# EAGLE design DPS_PWM-00 (EAGLE 7.2.0)
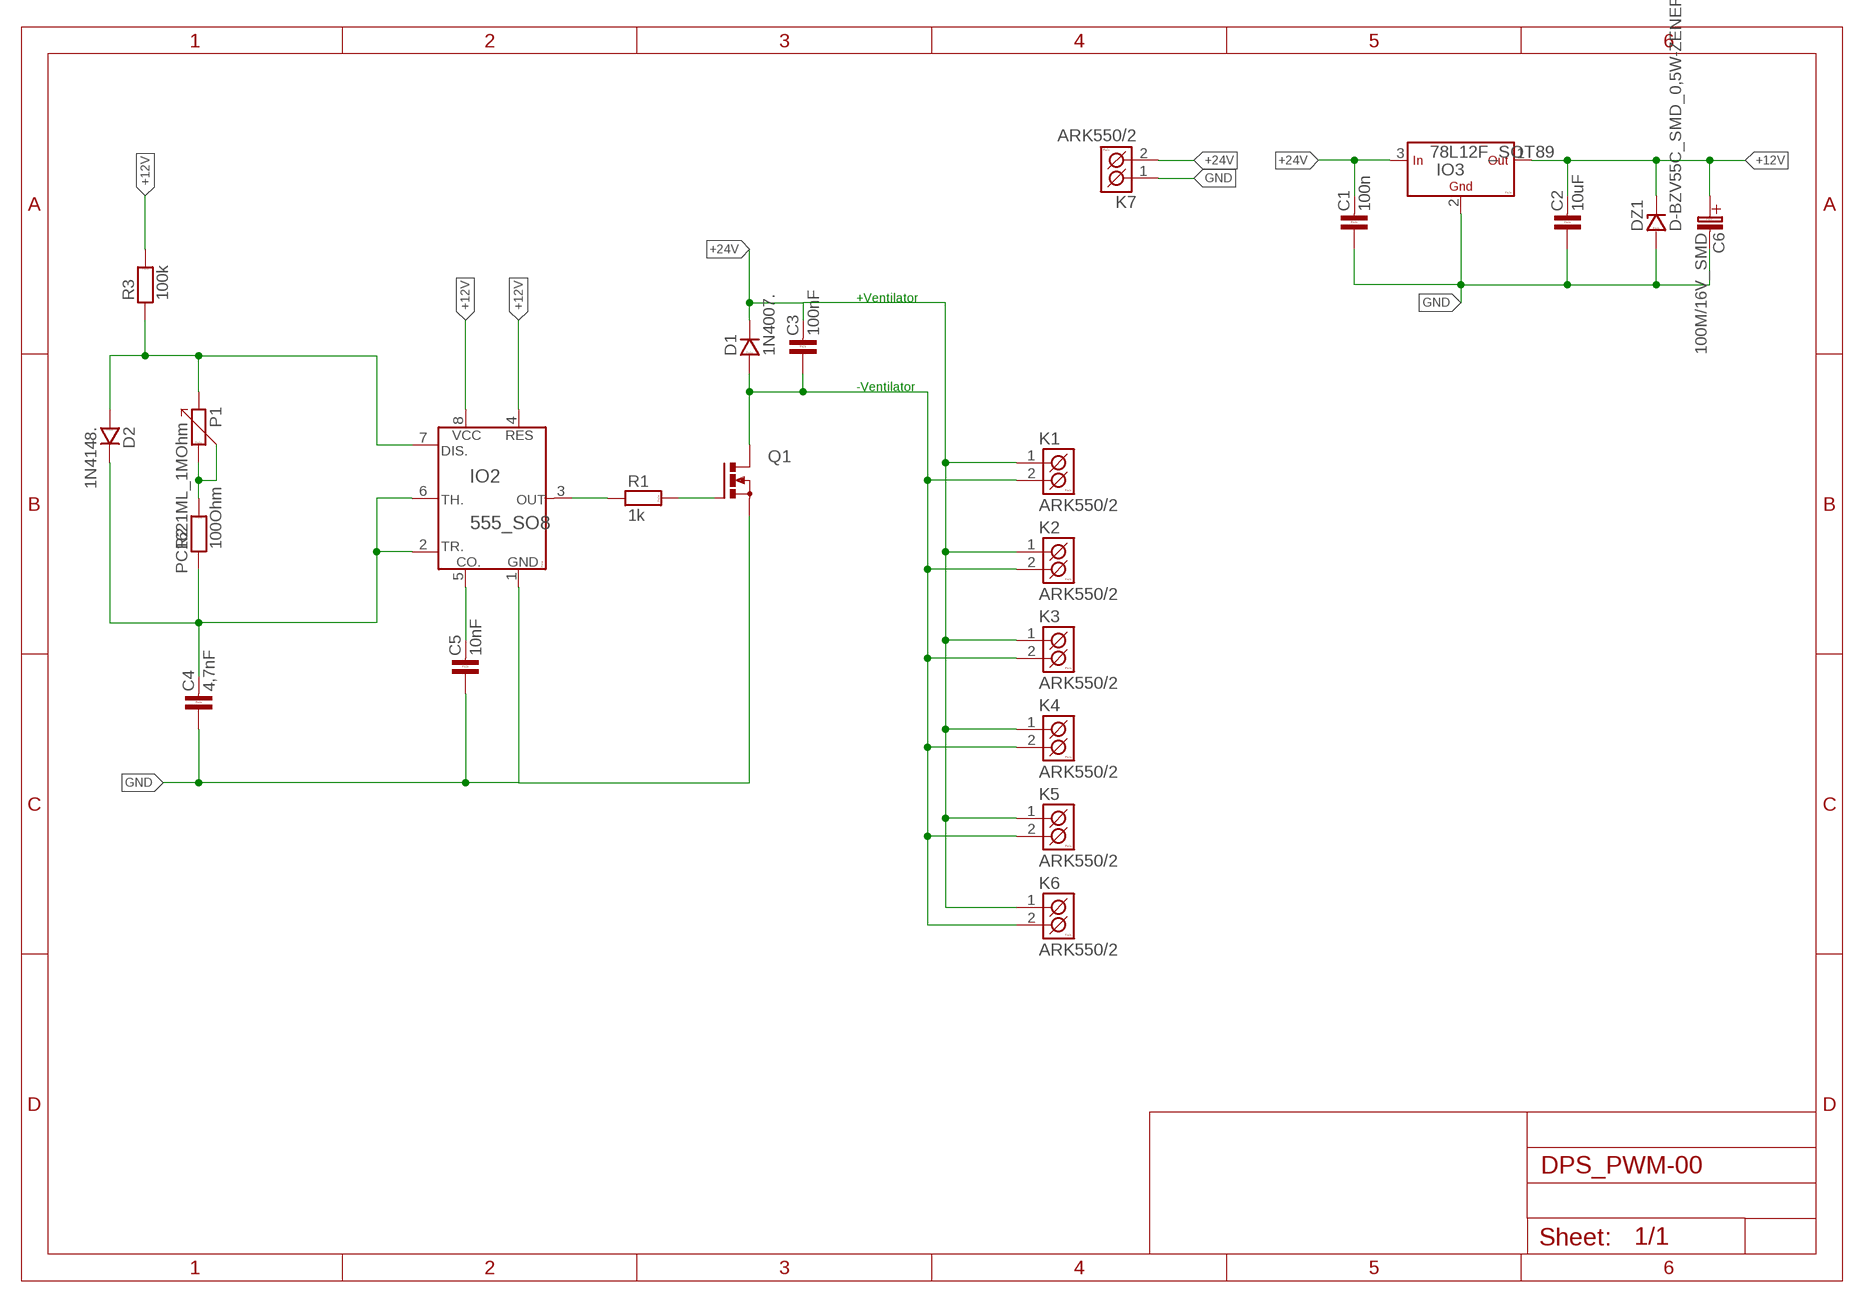
[diagram p0: schematic, sheet 1]

## Parts
C1  100n  C-KER_1206  [1206]
C2  10uF  C-KER_1206  [1206]
C3  100nF  C-KER_1206  [1206]
C4  4,7nF  C-KER_1206  [1206]
C5  10nF  C-KER_1206  [1206]
C6  100M/16V_SMD  [C_EL-SMD_D]
D1  1N4007.  [SM-1]
D2  1N4148.  [SOD-80]
DZ1  D-BZV55C_SMD_0,5W-ZENER  [SOD-80]
IO2  555_SO8  [SO08]
IO3  78L12F_SOT89  78_SOT  [SOT-89]
K1  ARK550/2  [ARK550/2]
K2  ARK550/2  [ARK550/2]
K3  ARK550/2  [ARK550/2]
K4  ARK550/2  [ARK550/2]
K5  ARK550/2  [ARK550/2]
K6  ARK550/2  [ARK550/2]
K7  ARK550/2  [ARK550/2]
P1  PC1621ML_1MOhm  PC16ML  [PC16ML]
Q1  PMOSFET_NTO220BH  [TO220BH]
R1  1k  R_1206  [1206]
R2  100Ohm  R_1206  [1206]
R3  100k  R_1206  [1206]

## Nets
+12V: C2.2 C6.+(C_EL+) DZ1.K IO2.4(RES) IO2.8(VCC) IO3.1(OUT) R3.2
+24V: C1.2 C3.2 D1.K IO3.3(IN) K1.1(K1) K2.1(K1) K3.1(K1) K4.1(K1) K5.1(K1) K6.1(K1) K7.2(K2)
GND: C1.1 C2.1 C4.1 C5.1 C6.-(C_EL-) DZ1.A IO2.1(GND) IO3.2(GND) K7.1(K1) Q1.S
N$1: C4.2 D2.K IO2.2(TR.) IO2.6(TH.) R2.1
N$2: P1.2 P1.3 R2.2
N$3: D2.A IO2.7(DIS.) P1.1 R3.1
N$6: C5.2 IO2.5(CO.)
N$7: Q1.G R1.2
N$8: IO2.3(OUT) R1.1
N$9: C3.1 D1.A K1.2(K2) K2.2(K2) K3.2(K2) K4.2(K2) K5.2(K2) K6.2(K2) Q1.D

## Notes on the sheet
- +Ventilator
- -Ventilator

## Library data of the parts
C1-C5 = #PaJa_31:C-KER: Kondenzator - keramicky
C6 = #PaJa_C-el_2:100M/16V
D1 = #PaJa_31:1N4007: Usmernovaci dioda - 1A, 1000V
D2 = #PaJa_31:1N4148: Univerzalni dioda - 0,15A, 75V
DZ1 = #PaJa_31:D-?-ZENER: Zenerova dioda
IO2 = #PaJa_31:555: IO - Casovac 555
IO3 = #PaJa_31:78?: Stabilizator - 1A a 1,5A ? - napeti => 05, 06, 08, 09, 12, 15, 18, 20, 24 => 1,5A ? - napeti => 10, 12, 15, 18 => 1A S ? - napeti => 05, 09, 10, 12, 15, 18, 24 => 2A T ? - napeti => 05 => 3A ------------------------------------------------------- Stabilizator - 100mA (TO-92 , SOT-89) ? - napeti => 02, 05, 06, 08, 09, 12, 15, 18
K1-K7 = #PaJa_konektory:ARK550/2: Svorkovnice - roztec 3,5mm - dvojita
P1 = #PaJa_31:PC16ML: Potenciometr - plastovy - mono - 100R az 5M
Q1 = transistor-power:PMOSFET_N: Power MOSFET N-Channel
R1-R3 = #PaJa_31:R: Rezistor

## Board
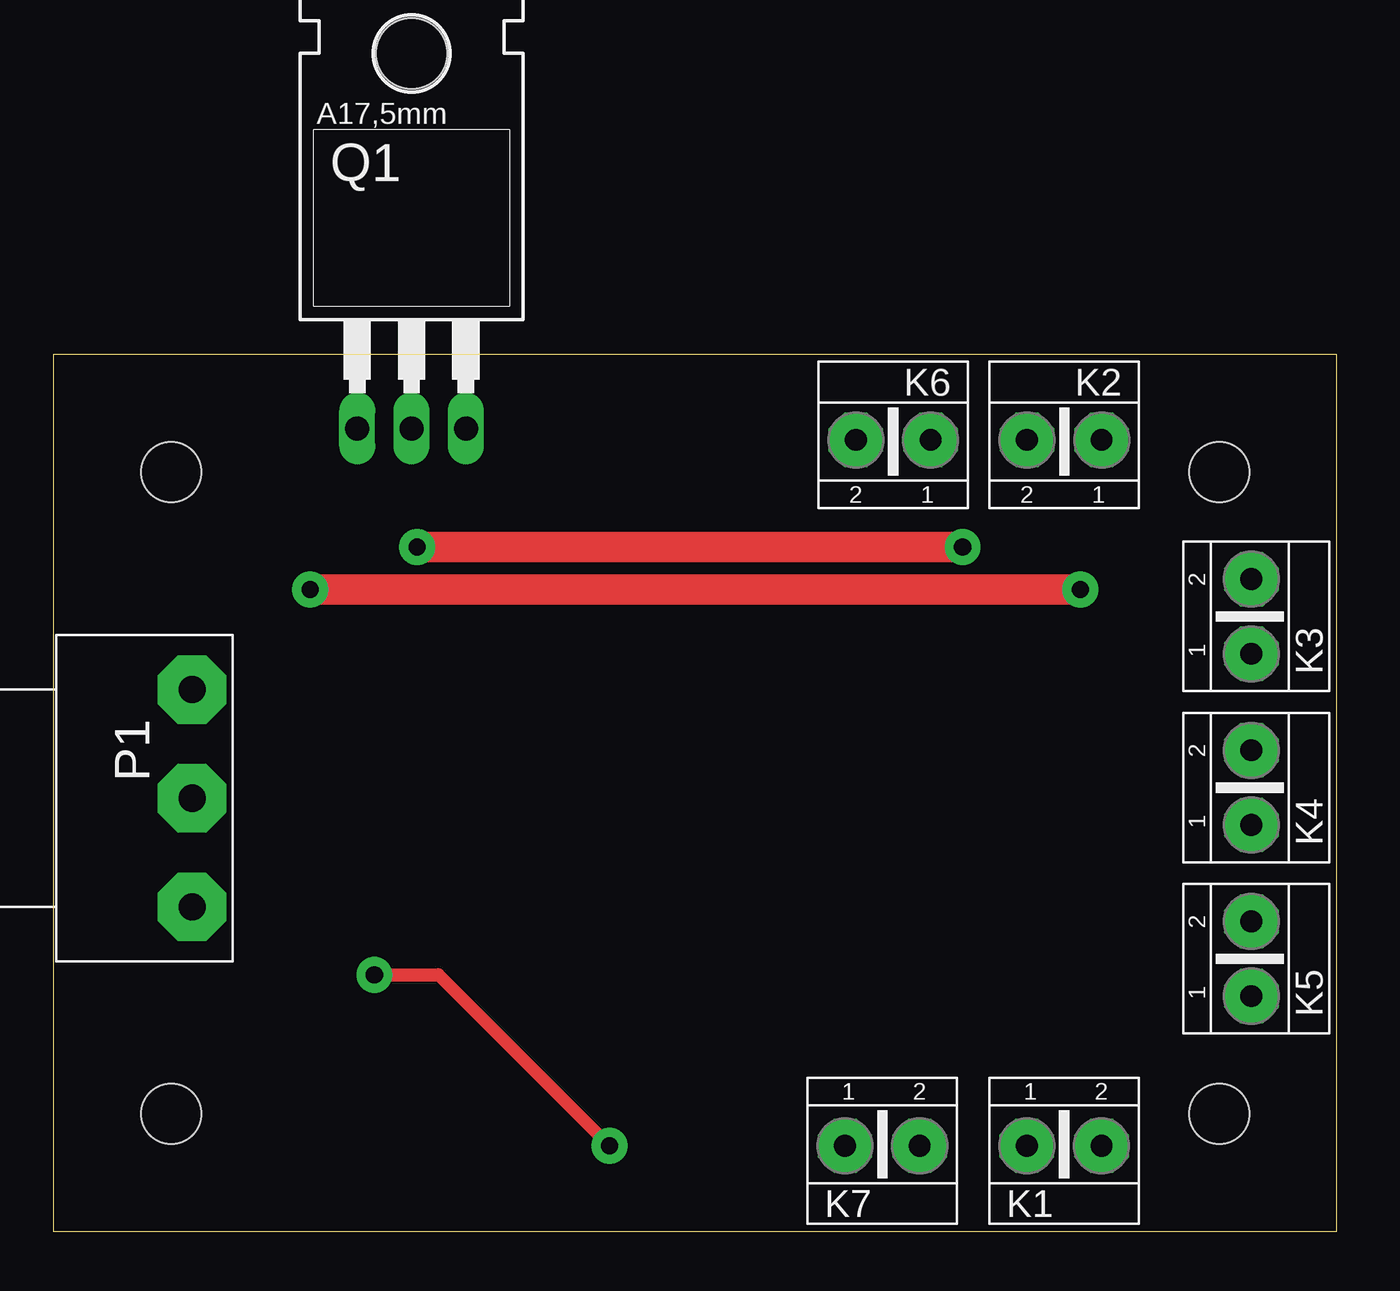
[diagram p1: board, top side]
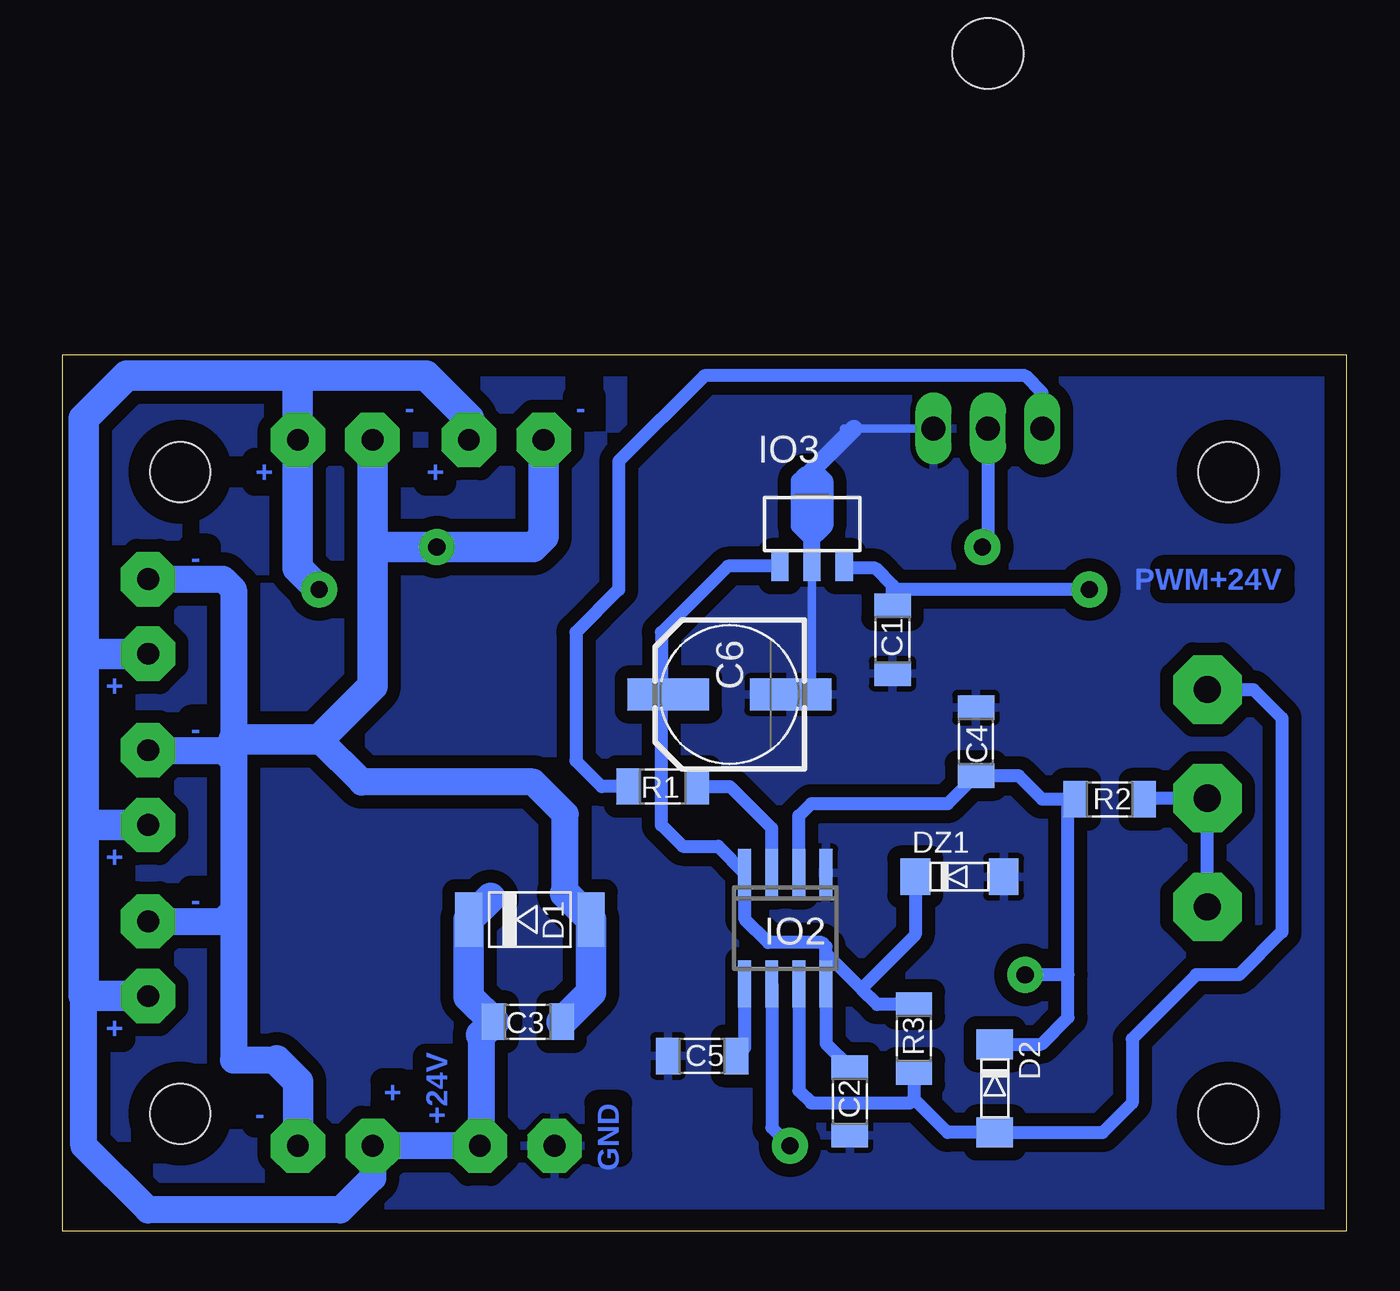
[diagram p2: board, bottom side, seen from below]

Size 60 x 41 mm. Coordinates in mm from the lower left corner, seen from the top.
Outline: 0,0 60,0 60,41 0,41 0,0
Copper layers (1*16): Top 0.035mm / dielectric 1.5mm / Bottom 0.035mm
Design rules "default": minimum track width 10mil, minimum drill 24mil, track to track 8mil, track to pad 8mil, pad to pad 8mil, via to via 8mil, smd to smd 8mil, copper to edge 40mil, drill to drill 8mil, minimum pad ring 10mil, minimum via ring 8mil, stop-mask expansion 4mil, vias tented up to drill 0mil, thermal gap 10mil
Holes 2.8 mm at 5.5,5.5 5.5,35.5 54.5,35.5 54.5,5.5

### Footprints (pad centres in the part's own frame; a part is rotated, then mirrored left to right if it is on the bottom)
1206 = smd 1.143 x 1.702: 1 -1.587,0; 2 1.587,0
C_EL-SMD_D = smd 3.81 x 1.473: + 2.857,0; - -2.857,0
SM-1 = smd 1.27 x 2.54: A 2.857,0; K -2.857,0
SOD-80 = smd 1.397 x 1.702: A 1.905,0; K -2.223,0
SO08 = smd 0.6 x 2.2: 1 -1.905,-2.6; 2 -0.635,-2.6; 3 0.635,-2.6; 4 1.905,-2.6; 5 1.905,2.6; 6 0.635,2.6; 7 -0.635,2.6; 8 -1.905,2.6
SOT-89 = smd 0.8 x 1.4: 1 -1.499,-1.981; 2 0,-1.981; 3 1.499,-1.981
ARK550/2 = drill 1.016 pad 2.54 octagon: 1 0,0; 2 3.493,0
PC16ML = drill 1.27 pad 3.2 octagon: 1 -5.08,0; 2 5.08,0; 3 0,0
TO220BH = drill 1.118 long: D 0,-6.35; G -2.54,-6.35; S 2.54,-6.35 | hole 3.302: 0,11.176

### Placement (x,y rotation side)
C1  21.2,27.66 90 bottom
C2  23.2,6.08 90 bottom
C3  38.25,9.8 180 bottom
C4  17.3,22.9 270 bottom
C5  30.1,8.2 0 bottom
C6  28.82,25.1 180 bottom
D1  38.15,14.58 0 bottom
D2  16.42,6.53 270 bottom
DZ1  17.91,16.58 0 bottom
IO2  26.21,14.17 180 bottom
IO3  24.96,33.08 0 bottom
K1  45.5,4 0 top
K2  49,37 180 top
K3  56,27 90 top
K4  56,19 90 top
K5  56,11 90 top
K6  41,37 180 top
K7  37,4 0 top
P1  6.48,20.25 270 top
Q1  16.74,43.89 0 top
R1  31.94,20.8 180 bottom
R2  11.05,20.2 0 bottom
R3  20.2,9.02 90 bottom

### Tracks (layer width: path | path; a pad name or v marks a point on that pad's centre or on a via)
+12V
  Bottom 0.61: IO3.1 28.9,31.1 32,28 32,25.42 C6.+ 32,24.78 32,19 31,18 29.34,18 IO2.4 | IO2.4 28.11,17.11 | 24.3,13 IO2.8 24.3,8.77 C2.2 | 24.3,13 24.3,13.3 24.5,13.5 27,13.5 28.11,14.62 IO2.4 | R3.2 21.91,10.61 22.65,11.35 | 22.65,11.35 24.3,13 | 22.65,11.35 20.13,13.87 DZ1.K
+24V  (via drill 0.8 pad 1.68)
  Top 1.422: v48,30 v12,30
  Bottom 0.61: C1.2 21.2,30 | 21.2,30 21.2,30.2 22,31 23.36,31 IO3.3 | v12,30 21.2,30
  Bottom 1.27: 59,11 59,4 56,1 47,1 45.5,2.5 K1.1 K7.2 40.44,4.05 40.44,9.2
  Bottom 1.422: 58,27 K3.1 59,27 | 59,27 59,38 57,40 49,40 | 59,27 59,19 | 59,19 59,11 K5.1 | K4.1 59,19 | 40.44,9.2 C3.2 41.01,10.97 D1.K 40,15.59 | K6.1 41,38 43,40 49,40 | 49,40 K2.1 49,31 v48,30
GND
  Bottom 0.406: C6.- 24.96,25.1 IO3.2 24.96,33.96 25,34 | Q1.S 23,37.54 23.46,37.54
  Bottom 0.813: 25,34 25,35.54 23,37.54
  pour Bottom (isolate 0.61): 0,0 60,0 60,41 0,41
N$1  (via drill 0.8 pad 1.68)
  Top 0.61: v15,12 18,12 v26,4
  Bottom 0.61: D2.K 14.25,8.75 13,10 13,12 | 13,12 13,19.84 R2.1 14.2,20.2 15.31,21.31 C4.2 18.61,20 25,20 25.57,19.43 IO2.2 | 13,12 v15,12 | IO2.6 26.84,4.84 v26,4
N$2
  Bottom 0.61: R2.2 9.41,20.25 P1.3 P1.2
N$3
  Bottom 0.61: R3.1 20.2,6.2 | 20.2,6.2 18.62,4.62 D2.A 11.38,4.62 10,6 10,9 7,12 5,12 3,14 3,24 4.33,25.33 P1.1 | IO2.7 25.57,6.58 25,6 20.4,6 20.2,6.2
N$4
  pour Bottom (isolate 0.61): 34,0 60,0 60,41 34,41
N$6
  Bottom 0.61: IO2.5 28.11,8.6 C5.2
N$7
  Bottom 0.61: R1.2 34.8,20.8 36,22 36,28 34,30 34,36 30,40 15,40 14.2,39.2 Q1.G
N$8
  Bottom 0.61: IO2.3 26.84,18.84 28.8,20.8 R1.1
N$9  (via drill 0.8 pad 1.68)
  Top 1.422: v17,32 v42.5,32 v42.51,32
  Bottom 0.61: Q1.D 16.74,32.26 v17,32
  Bottom 1.27: 52,22 52,23 52,30 52.49,30.49 K3.2 | 52,22 52,15 | 52,15 52,8 50,8 | K5.2 52.51,14.49 52,15 | K4.2 52.49,22.49 52,22 | 36.51,15.79 36.51,19.51 38,21 46,21 48,23
  Bottom 1.422: C3.1 35.29,11.17 D1.A 36.51,15.79 | 45.51,32 v42.5,32 38,32 37.51,32.49 K6.2 | K2.2 45.51,32 | 45.51,32 45.51,25.49 48,23 52,23 | K1.2 48.99,6.99 50,8

### Text on the board
Bottom: - | - | + | + | PWM+24V | - | + | - | + | - | + | GND | + | +24V | -